# Altium project Fonte simetrica.PrjPcb
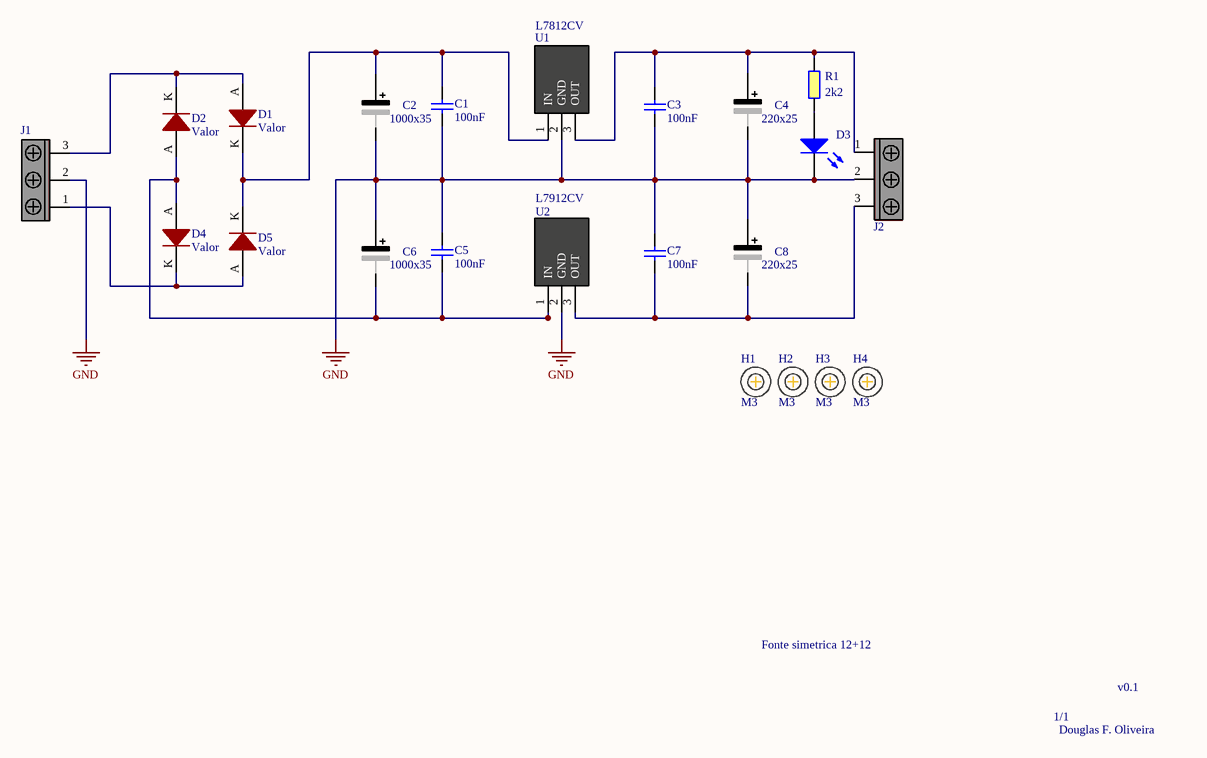
[diagram p0: Sch Simetrica.SchDoc]
1 sheet, 22 parts. Net scope: global (net labels, ports and power ports of the same name join across sheets).
Board file: Layout Simetrica.PcbDoc

## Sheet Sch Simetrica.SchDoc
size A4; SheetNumber: 1; SheetTotal: 1; SPICEModelCacheSXTRIKXO: <root> / <DocumentId>SXTRIKXO</DocumentId> / <CacheFrame Number="0"> / <Model Name="cap" Kind="MDL"> / <Text>*Default semiconductor capacitor / .MODEL CAP C()</Text> / </Model> / <Model Name="led0" Kind="MDL"> / <Text>*Typ INFRARED GaAs LED: Vf=1.2V Vr=5V If=40mA trr=3uS / *LED Pinout: 1=A, 2=K / .MODEL LED0 D (IS=93.5P RS=84M N=2.63 BV=5 IBV=10U / + CJO=2.97P VJ=.75 M=.333 TT=4.32U)</Text> / </Model> / </CacheFrame> / </root>

### Parts
C1  100nF  [RAD-0.2]
C2  1000x35  [CAP ELETROLITICO 1000]
C3  100nF  [RAD-0.2]
C4  220x25  [CAP ELETROLITICO 220]
C5  100nF  [RAD-0.2]
C6  1000x35  [CAP ELETROLITICO 1000]
C7  100nF  [RAD-0.2]
C8  220x25  [CAP ELETROLITICO 220]
D1  Valor  [DIOAD1405W58L465D235]
D2  Valor  [DIOAD1405W58L465D235]
D3  LED  [LED_3MM_RED]  (value not drawn)
D4  Valor  [DIOAD1405W58L465D235]
D5  Valor  [DIOAD1405W58L465D235]
H1  M3  [Parafuso M3]
H2  M3  [Parafuso M3]
H3  M3  [Parafuso M3]
H4  M3  [Parafuso M3]
J1  Conector 2v Phoenix  [Terminal block 5mm 3V]  (value not drawn)
J2  Conector 2v Phoenix  [Terminal block 5mm 3V]  (value not drawn)
R1  2k2  [RES 1/4 PTH]
U1  L7812CV  [TO220]
U2  L7912CV  [TO220]

### Nets
GND: C1.1 C2.2(-) C3.1 C4.2(-) C5.2 C6.1(+) C7.2 C8.1(+) D3.2(K) J1.2 J2.2 U1.2(GND) U2.2(GND)
NetC1_2: C1.2 C2.1(+) D1.K D5.K U1.1(IN)
NetC3_2: C3.2 C4.1(+) J2.1 R1.2 U1.3(OUT)
NetC5_1: C5.1 C6.2(-) D2.A D4.A U2.1(IN)
NetC7_1: C7.1 C8.2(-) J2.3 U2.3(OUT)
NetD1_A: D1.A D2.K J1.3
NetD3_1: D3.1(A) R1.1
NetD4_K: D4.K D5.A J1.1

### Notes on the sheet
- Fonte simetrica 12+12
- 1/1
- v0.1
- Douglas F. Oliveira

### Library data of the parts
C1 C3 C5 C7 = C: Capacitor; Value: 1; Manufacturer: *; PartNumber: *; Package Type: *
C2 C4 C6 C8 = CAP POL: Polarized Capacitor (Radial); Published: 8-Jun-2000; LatestRevisionDate: 17-Jul-2002; LatestRevisionNote: Re-released for DXP Platform.; PackageReference: RB7.6-15; Publisher: Altium Limited; PackageDescription: Polarized Capacitor (Radial); 2 Leads
D1 D2 D4 D5 = DIODO 1N4007: Retificador 1A 1000v; Published: 8-Jun-2000; LatestRevisionDate: 17-Jul-2002; LatestRevisionNote: Re-released for DXP Platform.; DatasheetVersion: 1998; PackageVersion: Aug-1999; PackageReference: DO-41; Publisher: Altium Limited; PackageDescription: Diode, Axial; Body 5.2 x 2.7 mm (LxDia. max), Lead Dia. 0.86 mm (max); Code_JEDEC: DO-204-AL; ComponentLink1Description: Manufacturer Link; ComponentLink1URL: http://www.fairchildsemi.com/; ComponentLink2Description: Datasheet; ComponentLink2URL: http://www.fairchildsemi.com/ds/1N%2F1N4001.pdf
H1-H4 = Furo M3
J1 J2 = Conector 3v Phoenix_1: Block, Terminal; 6 A; 63 V; 2.54 mm; 26 to 20 AWG; 2; Screw; Soldering; 1.5 kV; Manufacturer: Phoenix Contact; Manufacturer Part Number: 1725656; Current Rating: 6A; Voltage Rating: 125V; Number of Positions: 2; Number of Levels: 1; Connector Type: Screw,PCB,Terminal Block; Max Supply Voltage: 63V; Pitch: 2.54mm; Wire Gauge (Max): 26AWG; Wire Gauge (Min): 20AWG; Stripping Length: 4.5mm; Approvals: UL,CSA,cULus,EAC; RoHS: Yes; Category: Terminal Blocks; Stock 1: 29866; Pricing 1: 1=1,94000, 10=1,76000, 50=1,69000, 100=1,64000, 1000=1,27000, 10000=1,17000 (USD); Mount: Through Hole; Number of Pins: 2; Contact Material: Tin; Weight: 0.022575oz; Housing Material: Polyamide; Color: Green; Housing Color: Green; Insulation Material: Nylon; Package Quantity: 50; Packaging: Bulk; Termination: Solder; Series: MPT; Max Current Rating: 6A; Number of Contacts: 2; Number of Rows: 1; Number of Positions Per Level: 2; Current: 6A; Voltage: 125V; Orientation: Straight; Number of Poles: 2; Number of Circuits: 2; Length: 5.54mm; Width: 12mm; Height: 6.2mm; Depth: 6.2mm; Wire/Cable Gauge: 26AWG; Radiation Hardening: No; RoHS Compliant: Yes; Lead Free: Lead Free; Flammability Rating: UL94 V-0; Reach SVHC Compliant: Yes; ComponentLink1URL: https://datasheet.ciiva.com/16071/1725656-16071846.pdf?src-supplier=Onlinecomponents.com; ComponentLink1Description: https://datasheet.ciiva.com/16071/1725656-16071846.pdf?src-supplier=Onlinecomponents.com; ComponentLink2URL: https://datasheet.ciiva.com/15169/getdatasheetpartid-199323-15169849.pdf?src-supplier=Verical; ComponentLink2Description: https://datasheet.ciiva.com/15169/getdatasheetpartid-199323-15169849.pdf?src-supplier=Verical; ComponentLink3URL: https://datasheet.ciiva.com/823/1725656-823793.pdf?src-supplier=Digi-Key; ComponentLink3Description: https://datasheet.ciiva.com/823/1725656-823793.pdf?src-supplier=Digi-Key; ComponentLink4URL: https://datasheet.ciiva.com/1120/319957-1120510.pdf?src-supplier=Farnell; ComponentLink4Description: https://datasheet.ciiva.com/1120/319957-1120510.pdf?src-supplier=Farnell; ComponentLink5URL: https://datasheet.ciiva.com/26340/788052-da-01-en-100ntklemme-1725656-250-st-26340907.pdf?src-supplier=Conrad; ComponentLink5Description: https://datasheet.ciiva.com/26340/788052-da-01-en-100ntklemme-1725656-250-st-26340907.pdf?src-supplier=Conrad; Supplier Part Number 1: 651-1725656
R1 = RESISTOR 1/4W: Resistor; Published: 8-Jun-2000; LatestRevisionDate: 17-Jul-2002; LatestRevisionNote: Re-released for DXP Platform.; PackageReference: AXIAL-0.4; Publisher: Altium Limited; PackageDescription: Axial Device, Thru-Hole; 2 Leads; 0.4 in Pin Spacing
U1 = L78XXCV: L7905CV, Voltage Regulator, Negative 1.5A -5 V, 3-Pin TO-220; Manufacturer_Name: STMicroelectronics; Geometry.Height: 4.6mm; Mouser Part Number: 511-L7905CV; Mouser Price/Stock: https://www.mouser.co.uk/ProductDetail/STMicroelectronics/L7905CV?qs=bZskSr8d5Y8JqSs%2FnmNLHA%3D%3D; Manufacturer_Part_Number: L7905CV; Datasheet Link: http://www.st.com/web/en/resource/technical/document/datasheet/CD00000450.pdf
U2 = L79XXCV: L7905CV, Voltage Regulator, Negative 1.5A -5 V, 3-Pin TO-220; Manufacturer_Name: STMicroelectronics; Geometry.Height: 4.6mm; Mouser Part Number: 511-L7905CV; Mouser Price/Stock: https://www.mouser.co.uk/ProductDetail/STMicroelectronics/L7905CV?qs=bZskSr8d5Y8JqSs%2FnmNLHA%3D%3D; Manufacturer_Part_Number: L7905CV; Datasheet Link: http://www.st.com/web/en/resource/technical/document/datasheet/CD00000450.pdf
D3 = LED: Manufacturer: *; PartNumber: *; Package Type: *